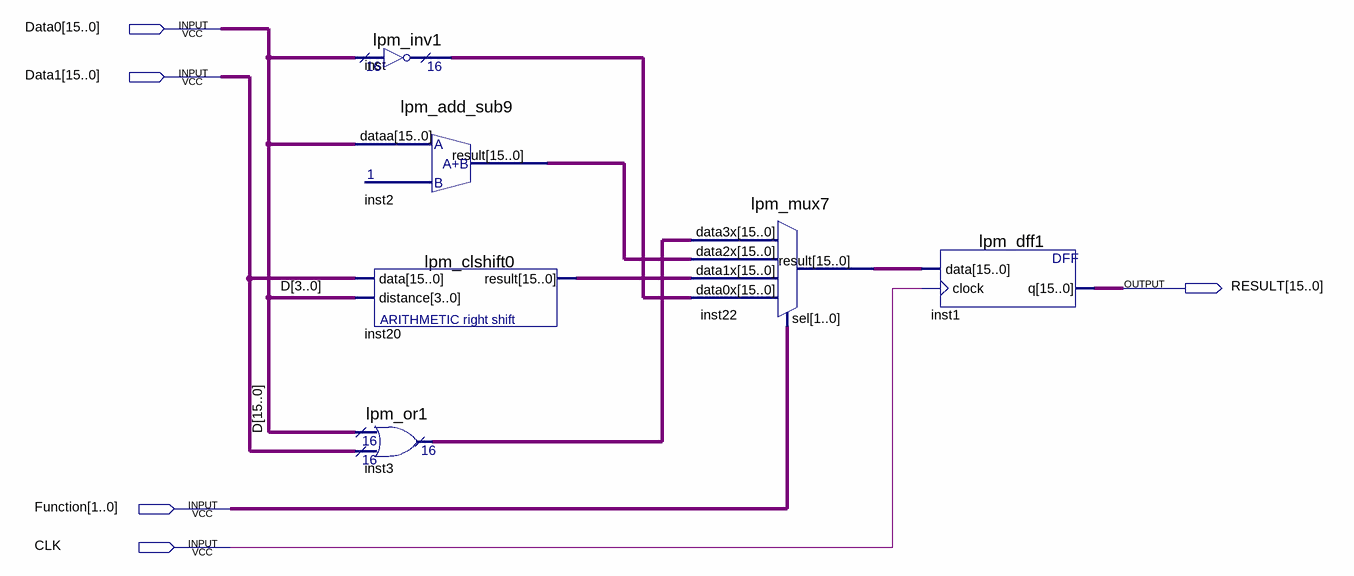
[diagram p0: schematic sheet]
// Quartus schematic ALU.bdf as structural Verilog: 6 symbols, 5 pins
module ALU (
  input  [15:0] Data0,
  input  [15:0] Data1,
  input  [1:0] Function,
  input  CLK,
  output [15:0] RESULT
);

  wire [15:0] inst2_result, inst3_result, inst20_result, inst22_result, inst_result;

  lpm_inv1 inst (.data(Data0), .result(inst_result));
  lpm_add_sub9 inst2 (.dataa(Data0), .result(inst2_result));
  lpm_clshift0 inst20 (.data(Data1), .distance(Data0[3:0]), .result(inst20_result));
  lpm_or1 inst3 (.data0x(Data0), .data1x(Data1), .result(inst3_result));
  lpm_mux7 inst22 (
    .data3x(inst3_result), .data2x(inst2_result), .data1x(inst20_result), .data0x(inst_result),
    .sel(Function), .result(inst22_result));
  lpm_dff1 inst1 (.data(inst22_result), .clock(CLK), .q(RESULT));

  // Other names for the same wires on the sheet: D[15:0] = Data0
endmodule
